# Altium schematic sheet SM2.SchDoc
size A
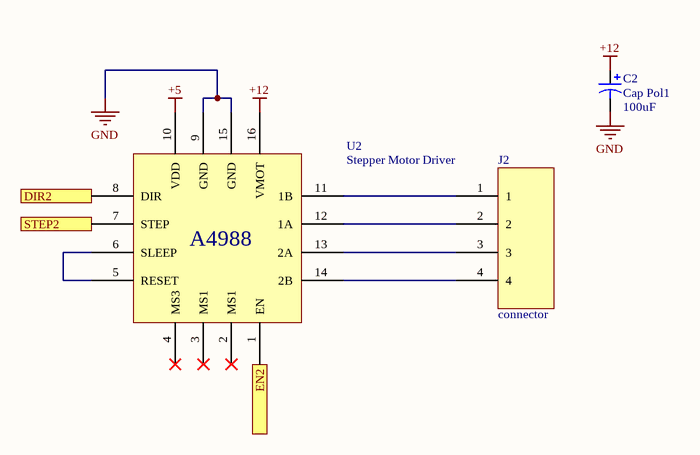
[diagram p0: SM2.SchDoc]

## Parts
C2  Cap Pol1  value 100uF  [RB7.6-15]
J2  connector
U2  Stepper Motor Driver

## Ports
DIR2, EN2, STEP2

## Nets
+5: U2.10(VDD)
+12: C2.1 U2.16(VMOT)
GND: C2.2 U2.9(GND) U2.15(GND)
DIR2: U2.8(DIR) ; port DIR2
EN2: U2.1(EN) ; port EN2
STEP2: U2.7(STEP) ; port STEP2
NetJ2_1: J2.1 U2.11(1B)
NetJ2_2: J2.2 U2.12(1A)
NetJ2_3: J2.3 U2.13(2A)
NetJ2_4: J2.4 U2.14(2B)
NetU2_5: U2.5(RESET) U2.6(SLEEP)

Not connected (* = marked no-connect by the designer): U2 2(MS1)* 3(MS1)* 4(MS3)*

## Library data of the parts
C2 = Cap Pol1: Polarized Capacitor (Radial); Published: 8-Jun-2000; LatestRevisionDate: 17-Jul-2002; LatestRevisionNote: Re-released for DXP Platform.; PackageReference: RB7.6-15; Publisher: Altium Limited; PackageDescription: Polarized Capacitor (Radial); 2 Leads
J2 = JST_4P
U2 = A4988